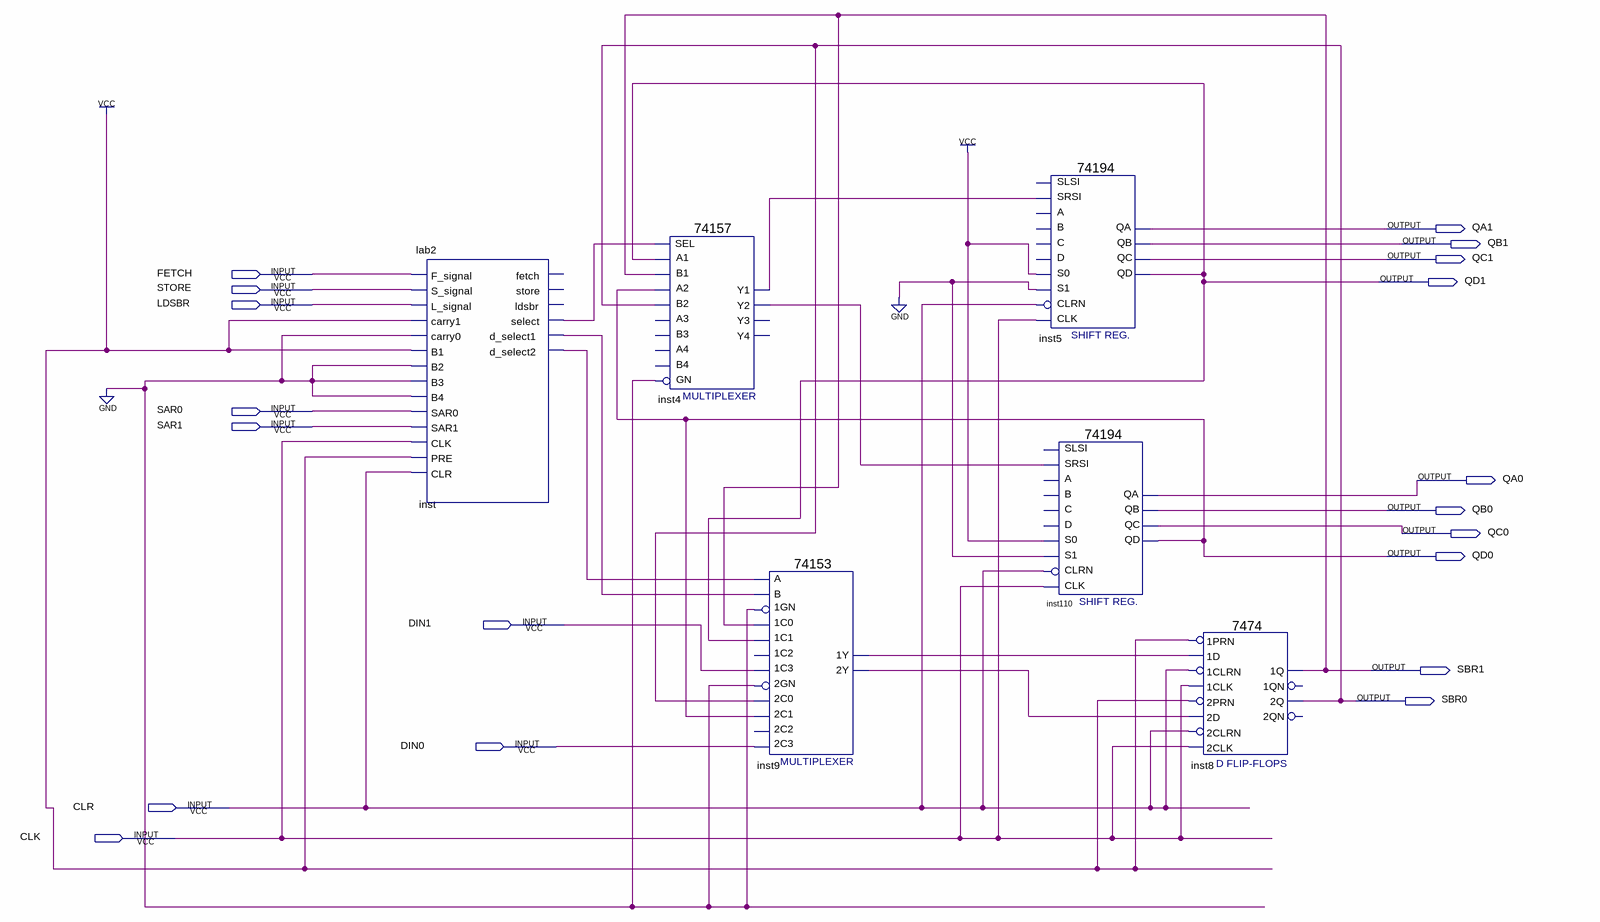
[diagram p0: schematic sheet]
// Quartus schematic Block9.bdf as structural Verilog: 6 symbols, 19 pins
module Block9 (
  input  FETCH,
  input  STORE,
  input  LDSBR,
  input  SAR0,
  input  SAR1,
  input  DIN1,
  input  DIN0,
  input  CLR,
  input  CLK,
  output QA1,
  output QB1,
  output QC1,
  output QD1,
  output QA0,
  output QB0,
  output QC0,
  output QD0,
  output SBR1,
  output SBR0
);

  wire inst4_y1, inst4_y2, inst9_1y, inst9_2y, inst_d_select1, inst_d_select2, inst_select;

  lab2 inst (
    .F_signal(FETCH), .S_signal(STORE), .L_signal(LDSBR), .carry1(1'b1), .carry0(1'b0), .B1(1'b1), .B2(1'b0),
    .B3(1'b0), .B4(1'b0), .SAR0(SAR0), .SAR1(SAR1), .CLK(CLK), .PRE(1'b1), .CLR(CLR), .select(inst_select),
    .d_select1(inst_d_select1), .d_select2(inst_d_select2));  // open: fetch, store, ldsbr
  \74157  inst4 (
    .A1(QD1), .B1(SBR1), .SEL(inst_select), .B2(SBR0), .A2(QD0), .GN(1'b0), .Y2(inst4_y2), .Y1(inst4_y1));  // open: A3, B3, B4, A4, Y4, Y3
  \74153  inst9 (
    .\1C1 (QD1), .\1GN (1'b0), .\1C0 (SBR1), .\2C0 (SBR0), .\2GN (1'b0), .\1C3 (DIN1), .B(inst_d_select1),
    .A(inst_d_select2), .\2C1 (QD0), .\2C3 (DIN0), .\1Y (inst9_1y), .\2Y (inst9_2y));  // open: 2C2, 1C2
  \74194  inst5 (
    .SRSI(inst4_y1), .CLK(CLK), .CLRN(CLR), .S1(1'b0), .S0(1'b1), .QA(QA1), .QB(QB1), .QC(QC1), .QD(QD1));  // open: SLSI, B, C, D, A
  \74194  inst110 (
    .SRSI(inst4_y2), .CLK(CLK), .CLRN(CLR), .S1(1'b0), .S0(1'b1), .QA(QA0), .QB(QB0), .QC(QC0), .QD(QD0));  // open: SLSI, B, C, D, A
  \7474  inst8 (
    .\2D (inst9_2y), .\2PRN (1'b1), .\1CLK (CLK), .\1D (inst9_1y), .\1PRN (1'b1), .\2CLK (CLK),
    .\2CLRN (CLR), .\1CLRN (CLR), .\2Q (SBR0), .\1Q (SBR1));  // open: 1QN, 2QN
endmodule
